# EAGLE design v3b_pcb (EAGLE 6.5.0)
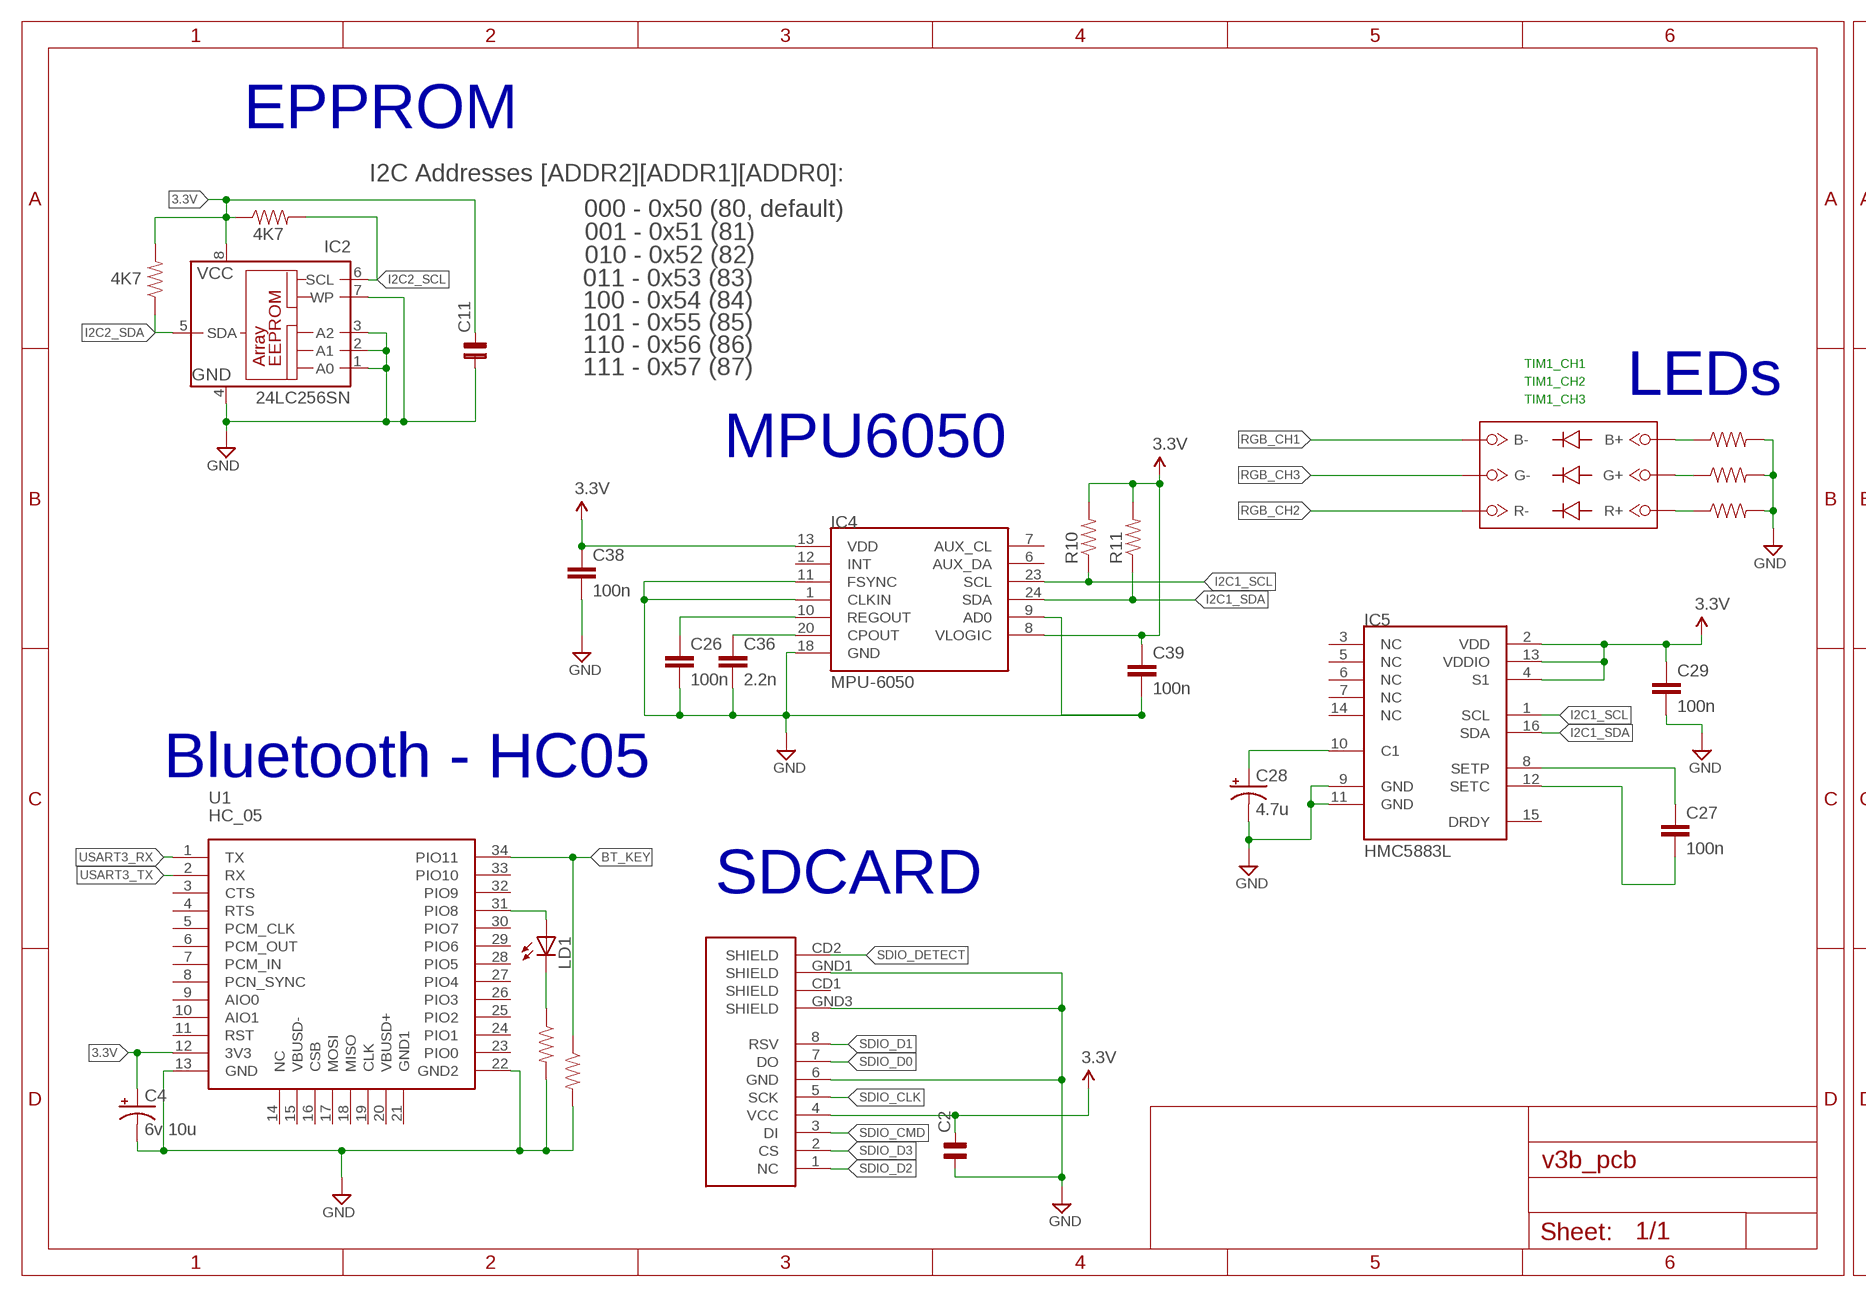
[diagram p0: schematic, sheet 1, part 1 of 2]
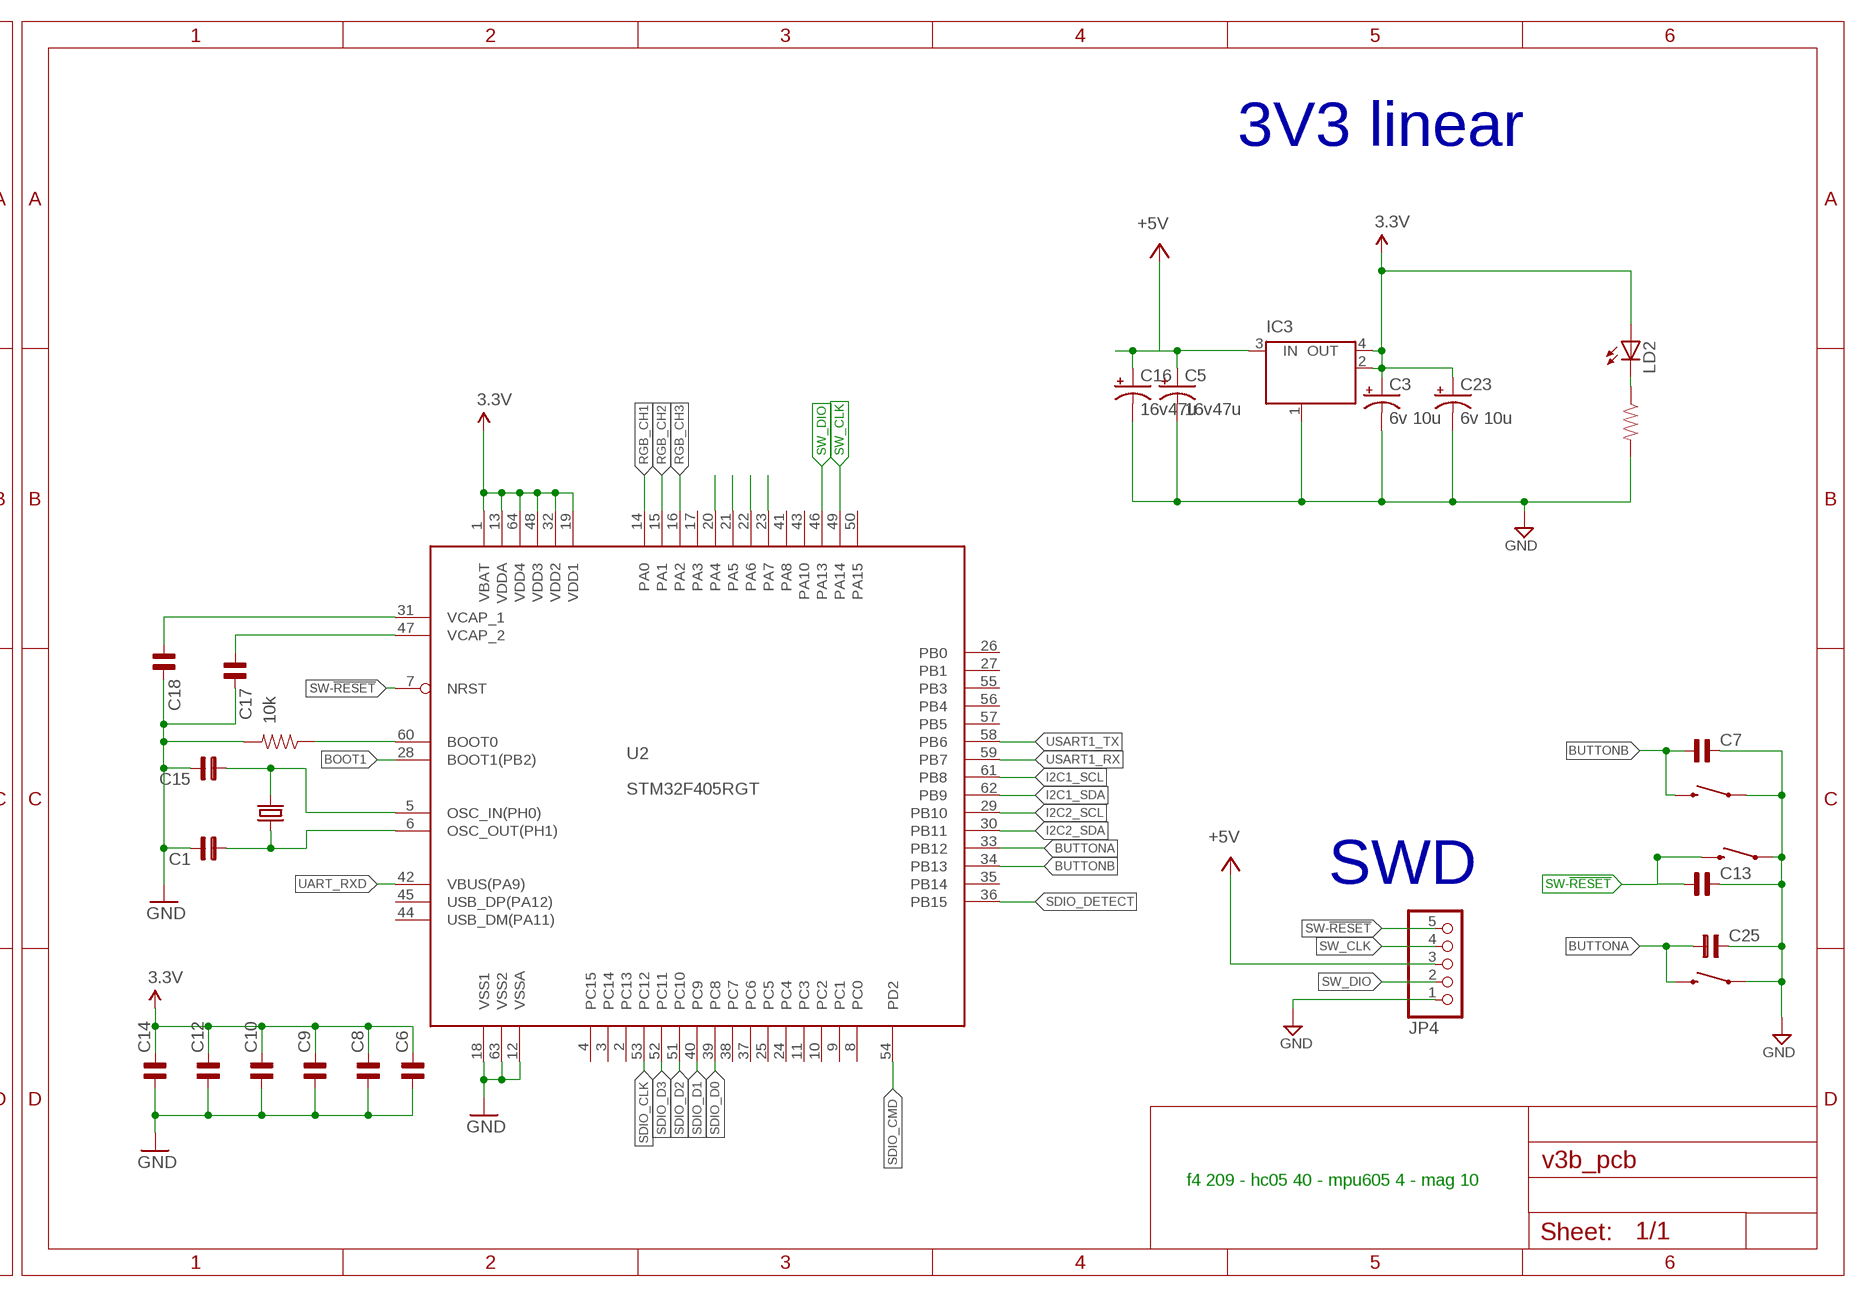
[diagram p1: schematic, sheet 1, part 2 of 2]

## Parts
C1  C-NP-SMD-0603  [C-0603]
C2  C-NP-SMD-0603  [C-0603]
C3  6v 10u  CPOL-USSMCC  [SMC_C]
C4  6v 10u  CPOL-USSMCA  [SMC_A]
C5  16v47u  CPOL-USSMCC  [SMC_C]
C6  C-NP-SMD-0603  [C-0603]
C7  C-NP-SMD-0603  [C-0603]
C8  C-NP-SMD-0603  [C-0603]
C9  C-NP-SMD-0603  [C-0603]
C10  C-NP-SMD-0603  [C-0603]
C11  C-NP-SMD-0603  [C-0603]
C12  C-NP-SMD-0603  [C-0603]
C13  C-NP-SMD-0603  [C-0603]
C14  C-NP-SMD-0603  [C-0603]
C15  C-NP-SMD-0603  [C-0603]
C16  16v47u  CPOL-USSMCC  [SMC_C]
C17  C-NP-SMD-0603  [C-0603]
C18  C-NP-SMD-0603  [C-0603]
C23  6v 10u  CPOL-USSMCC  [SMC_C]
C25  C-NP-SMD-0603  [C-0603]
C26  100n  SPARKFUN_CAP0603-CAP  [SPARKFUN_0603-CAP]
C27  100n  SPARKFUN_CAP0603-CAP  [SPARKFUN_0603-CAP]
C28  4.7u  CPOL-USSMCA  [SMC_A]
C29  100n  SPARKFUN_CAP0603-CAP  [SPARKFUN_0603-CAP]
C36  2.2n  SPARKFUN_CAP0603-CAP  [SPARKFUN_0603-CAP]
C38  100n  SPARKFUN_CAP0603-CAP  [SPARKFUN_0603-CAP]
C39  100n  SPARKFUN_CAP0603-CAP  [SPARKFUN_0603-CAP]
IC2  24LC256SN  [SO-08]
IC3  LINEAR_MC33269ST-3.3T3  [LINEAR_SOT223]
IC4  MPU-6050  TESTING_MPU-6050-1  [TESTING_QFN-24-4MM2]
IC5  HMC5883L  SPARKFUN_HMC5883LSMD  [SPARKFUN_16LPCC]
JP4  PINHD-1X5_2.54-90°  [1X05/90]
LD1  LEDCHIPLED_0603  [CHIPLED_0603]
LD2  LEDCHIPLED_0603  [CHIPLED_0603]
R1  10K  SPARKFUN_RESISTOR0603-RES  [SPARKFUN_0603-RES]
R2  10K  SPARKFUN_RESISTOR0603-RES  [SPARKFUN_0603-RES]
R3  10K  SPARKFUN_RESISTOR0603-RES  [SPARKFUN_0603-RES]
R5  10K  SPARKFUN_RESISTOR0603-RES  [SPARKFUN_0603-RES]
R6  10K  SPARKFUN_RESISTOR0603-RES  [SPARKFUN_0603-RES]
R7  10k  SPARKFUN_RESISTOR0603-RES  [SPARKFUN_0603-RES]
R9  10K  SPARKFUN_RESISTOR0603-RES  [SPARKFUN_0603-RES]
R10  SPARKFUN_RESISTOR0603-RES  [SPARKFUN_0603-RES]
R11  SPARKFUN_RESISTOR0603-RES  [SPARKFUN_0603-RES]
R15  4K7  SPARKFUN_RESISTOR0603-RES  [SPARKFUN_0603-RES]
R16  4K7  SPARKFUN_RESISTOR0603-RES  [SPARKFUN_0603-RES]
S1  RESET  SWITCH-MOMENTARY-2-SMD-1101NE  [TACTILE-SWITCH-1101NE]
S2  RESET  SWITCH-MOMENTARY-2-SMD-1101NE  [TACTILE-SWITCH-1101NE]
S4  RESET  SWITCH-MOMENTARY-2-SMD-1101NE  [TACTILE-SWITCH-1101NE]
SDCARD2  microSD Socket  USD-SOCKETNEW  [MICRO-SD-SOCKET-PP]
U1  HC_05  [BLUETOOTH_SMD]
U2  STM32F405RGT  [LQFP64]
U$12  RGB_LED  [SMD]
Y2  CRYSTALHC49US  [HC49US]

## Nets
3.3V: C2.2 C3.+ C4.+ C6.2 C8.2 C9.2 C10.2 C11.2 C12.2 C14.2 C23.+ C29.1 C38.1 C39.1 IC2.8(VCC) IC3.2(OUT) IC3.4(OUT) IC4.8(VLOGIC) IC4.13(VDD) IC5.2(VDD) IC5.4(S1) IC5.13(VDDIO) LD2.A R10.2 R11.2 R15.1 R16.2 SDCARD2.4(VCC) U1.12(3V3) U2.1(VBAT) U2.13(VDDA) U2.19(VDD1) U2.32(VDD2) U2.48(VDD3) U2.64(VDD4)
+5V: C5.+ C16.+ IC3.3(IN) JP4.3
BOOT0: R7.1 U2.60(BOOT0)
BOOT1: U2.28(BOOT1(PB2))
BT_KEY: R5.1 U1.34(PIO11)
BUTTONA: C25.1 S2.P$2 U2.33(PB12)
BUTTONB: C7.1 S4.P$2 U2.34(PB13)
GND: C1.2 C2.1 C3.- C4.- C5.- C6.1 C7.2 C8.1 C9.1 C10.1 C11.1 C12.1 C13.2 C14.1 C15.2 C16.- C17.2 C18.2 C23.- C25.2 C26.2 C28.- C29.2 C36.2 C38.2 C39.2 IC2.1(A0) IC2.2(A1) IC2.3(A2) IC2.4(GND) IC2.7(WP) IC3.1(GND/ADJ) IC4.1(CLKIN) IC4.9(AD0) IC4.11(FSYNC) IC4.18(GND) IC5.9(GND) IC5.11(GND) JP4.1 R1.2 R2.2 R3.2 R5.2 R6.2 R7.2 R9.2 S1.P$1 S2.P$1 S4.P$1 SDCARD2.6(GND) SDCARD2.GND1(SHIELD) SDCARD2.GND3(SHIELD) U1.13(GND) U1.22(GND2) U2.12(VSSA) U2.18(VSS1) U2.63(VSS2)
I2C1_SCL: IC4.23(SCL) IC5.1(SCL) R10.1 U2.61(PB8)
I2C1_SDA: IC4.24(SDA) IC5.16(SDA) R11.1 U2.62(PB9)
I2C2_SCL: IC2.6(SCL) R15.2 U2.29(PB10)
I2C2_SDA: IC2.5(SDA) R16.1 U2.30(PB11)
MISO: U2.22(PA6)
MOSI: U2.23(PA7)
N$2: R2.1 U$12.B+
N$3: C26.1 IC4.10(REGOUT)
N$4: LD1.A U1.31(PIO8)
N$5: LD1.C R9.1
N$6: R6.1 U$12.R+
N$7: R3.1 U$12.G+
N$8: C36.1 IC4.20(CPOUT)
N$10: C27.1 IC5.8(SETP)
N$11: LD2.C R1.1
N$12: C28.+ IC5.10(C1)
N$13: C27.2 IC5.12(SETC)
N$14: C15.1 U2.5(OSC_IN(PH0)) Y2.2
N$15: C1.1 U2.6(OSC_OUT(PH1)) Y2.1
N$18: C18.1 U2.31(VCAP_1)
N$19: C17.1 U2.47(VCAP_2)
NSS: U2.20(PA4)
RGB_CH1: U2.14(PA0) U$12.B-
RGB_CH2: U2.15(PA1) U$12.R-
RGB_CH3: U2.16(PA2) U$12.G-
SCK: U2.21(PA5)
SDIO_CLK: SDCARD2.5(SCK) U2.53(PC12)
SDIO_CMD: SDCARD2.3(DI) U2.54(PD2)
SDIO_D0: SDCARD2.7(DO) U2.39(PC8)
SDIO_D1: SDCARD2.8(RSV) U2.40(PC9)
SDIO_D2: SDCARD2.1(NC) U2.51(PC10)
SDIO_D3: SDCARD2.2(CS) U2.52(PC11)
SDIO_DETECT: SDCARD2.CD2(SHIELD) U2.36(PB15)
SW-!RESET: C13.1 JP4.5 S1.P$2 U2.7(NRST)
SW_CLK: JP4.4 U2.49(PA14)
SW_DIO: JP4.2 U2.46(PA13)
UART_RXD: U2.42(VBUS(PA9))
USART1_RX: U2.59(PB7)
USART1_TX: U2.58(PB6)
USART3_RX: U1.1(TX)
USART3_TX: U1.2(RX)
Unconnected: IC4.6(AUX_DA) IC4.7(AUX_CL) IC4.12(INT) IC5.3(NC) IC5.5(NC) IC5.6(NC) IC5.7(NC) IC5.14(NC) IC5.15(DRDY) SDCARD2.CD1(SHIELD) U1.3(CTS) U1.4(RTS) U1.5(PCM_CLK) U1.6(PCM_OUT) U1.7(PCM_IN) U1.8(PCN_SYNC) U1.9(AIO0) U1.10(AIO1) U1.11(RST) U1.14(NC) U1.15(VBUSD-) U1.16(CSB) U1.17(MOSI) U1.18(MISO) U1.19(CLK) U1.20(VBUSD+) U1.21(GND1) U1.23(PIO0) U1.24(PIO1) U1.25(PIO2) U1.26(PIO3) U1.27(PIO4) U1.28(PIO5) U1.29(PIO6) U1.30(PIO7) U1.32(PIO9) U1.33(PIO10) U2.2(PC13) U2.3(PC14) U2.4(PC15) U2.8(PC0) U2.9(PC1) U2.10(PC2) U2.11(PC3) U2.17(PA3) U2.24(PC4) U2.25(PC5) U2.26(PB0) U2.27(PB1) U2.35(PB14) U2.37(PC6) U2.38(PC7) U2.41(PA8) U2.43(PA10) U2.44(USB_DM(PA11)) U2.45(USB_DP(PA12)) U2.50(PA15) U2.55(PB3) U2.56(PB4) U2.57(PB5)

## Notes on the sheet
- EPPROM | 3V3 linear
- I2C Addresses [ADDR2][ADDR1][ADDR0]:
- 000 - 0x50 (80, default)
- 001 - 0x51 (81)
- 010 - 0x52 (82)
- 011 - 0x53 (83)
- 100 - 0x54 (84)
- 101 - 0x55 (85)
- 110 - 0x56 (86)
- TIM1_CH1
- 111 - 0x57 (87)
- TIM1_CH2
- LEDs
- TIM1_CH3
- MPU6050
- Bluetooth - HC05
- SDCARD
- SWD
- f4 209 - hc05 40 - mpu605 4 - mag 10
- TJA1040

## Library data of the parts
C1 C2 C6-C15 C17 C18 C25 = cap-pan40:C-NP: NON-POLARIZED FILM/CHIP
C3-C5 C16 C23 C28 = rcl:CPOL-US: POLARIZED CAPACITOR, American symbol
C26 C27 C29 C36 C38 C39 = Helios_RLC:SPARKFUN_CAP: Capacitor Standard 0603 ceramic capacitor, and 0.1" leaded capacitor.
IC2 = microchip:24*: Serial EEPROM I2C; DIGIKEY: 24LC256-E/SN-ND; MF: MICROCHIP; MPN: 24LC256-I/SN; OC_FARNELL: 9757996; OC_NEWARK: 27C9144
IC3 = Robotech_Other:LINEAR_MC33269ST*: Adjustable Output Low Dropout Voltage Regulator 800 mA Source: http://www.onsemi.com/pub/Collateral/MC33269-D.PDF
IC4 = Helios_IMU:TESTING_MPU-6050
IC5 = Helios_IMU:SPARKFUN_HMC5883L: 3 Axis Digital Compass IC
JP4 = pinhead-1:PINHD-1X5: PIN HEADER
LD1 LD2 = led:LED: LED OSRAM: - CHIPLED LG R971, LG N971, LY N971, LG Q971, LY Q971, LO R971, LY R971 LH N974, LH R974 LS Q976, LO Q976, LY Q976 LO Q996 - Hyper CHIPLED LW Q18S LB Q993, LB Q99A, LB R99A - SideLED LS A670, LO A670, LY A670, LG A670, LP A670 LB A673, LV A673, LT A673, LW A673 LH A674 LY A675 LS A676, LA A676, LO A676, LY A676, LW A676 LS A679, LY A679, LG A679 - Hyper Micro SIDELED® LS Y876, LA Y876, LO Y876, LY Y876 LT Y87S - SmartLED LW L88C, LW L88S LB L89C, LB L89S, LG L890 LS L89K, LO L89K, LY L89K LS L896, LA L896, LO L896, LY L896 - TOPLED LS T670, LO T670, LY T670, LG T670, LP T670 LSG T670, LSP T670, LSY T670, LOP T670, LYG T670 LG T671, LOG T671, LSG T671 LB T673, LV T673, LT T673, LW T673 LH T674 LS T676, LA T676, LO T676, LY T676, LB T676, LH T676, LSB T676, LW T676 LB T67C, LV T67C, LT T67C, LS T67K, LO T67K, LY T67K, LW E67C LS E67B, LA E67B, LO E67B, LY E67B, LB E67C, LV E67C, LT E67C LW T67C LS T679, LY T679, LG T679 LS T770, LO T770, LY T770, LG T770, LP T770 LB T773, LV T773, LT T773, LW T773 LH T774 LS E675, LA E675, LY E675, LS T675 LS T776, LA T776, LO T776, LY T776, LB T776 LHGB T686 LT T68C, LB T68C - Hyper Mini TOPLED® LB M676 - Mini TOPLED Santana® LG M470 LS M47K, LO M47K, LY M47K Source: http://www.osram.convergy.de/
R1-R3 R5-R7 R9 R15 R16 = Robotech_RCL:SPARKFUN_RESISTOR: Resistor Basic schematic elements and footprints for 0603, 1206, and PTH resistors.
R10 R11 = Helios_RLC:SPARKFUN_RESISTOR: Resistor Basic schematic elements and footprints for 0603, 1206, and PTH resistors.
S1 S2 S4 = pixhawk2:SWITCH-MOMENTARY-2; PARTNO: EVQ-P7J01P
SDCARD2 = SparkFun:USD-SOCKET: microSD Socket Push-push type uSD socket. Schematic element and footprint production proven. Spark Fun Electronics SKU : PRT-00127. tDoc lines correctly indicate media card edge positions when inserting (unlocked, locked, depressed).
U1 = SerialPortBluetooth:HC_05
U2 = m4quad:STM32F405RGT
U$12 = RGB_LED:RGB_LED
Y2 = SparkFun-FreqCtrl:CRYSTAL: Various standard crystals. Proven footprints. Spark Fun Electronics SKU : COM-00534

## Net classes
1 power: width 0.15 mm, drill 0.2 mm, clearance 0.152 mm

## Board
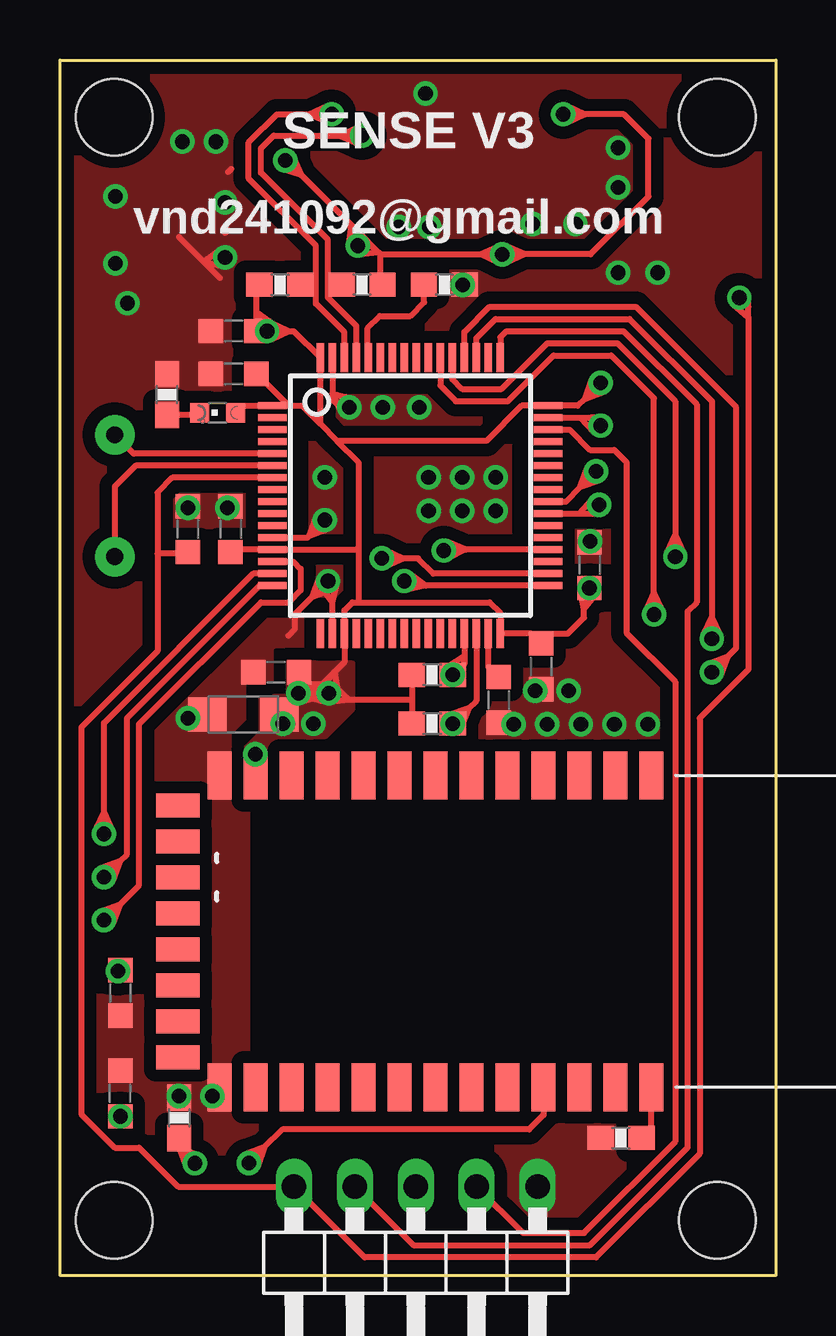
[diagram p2: board, top side]
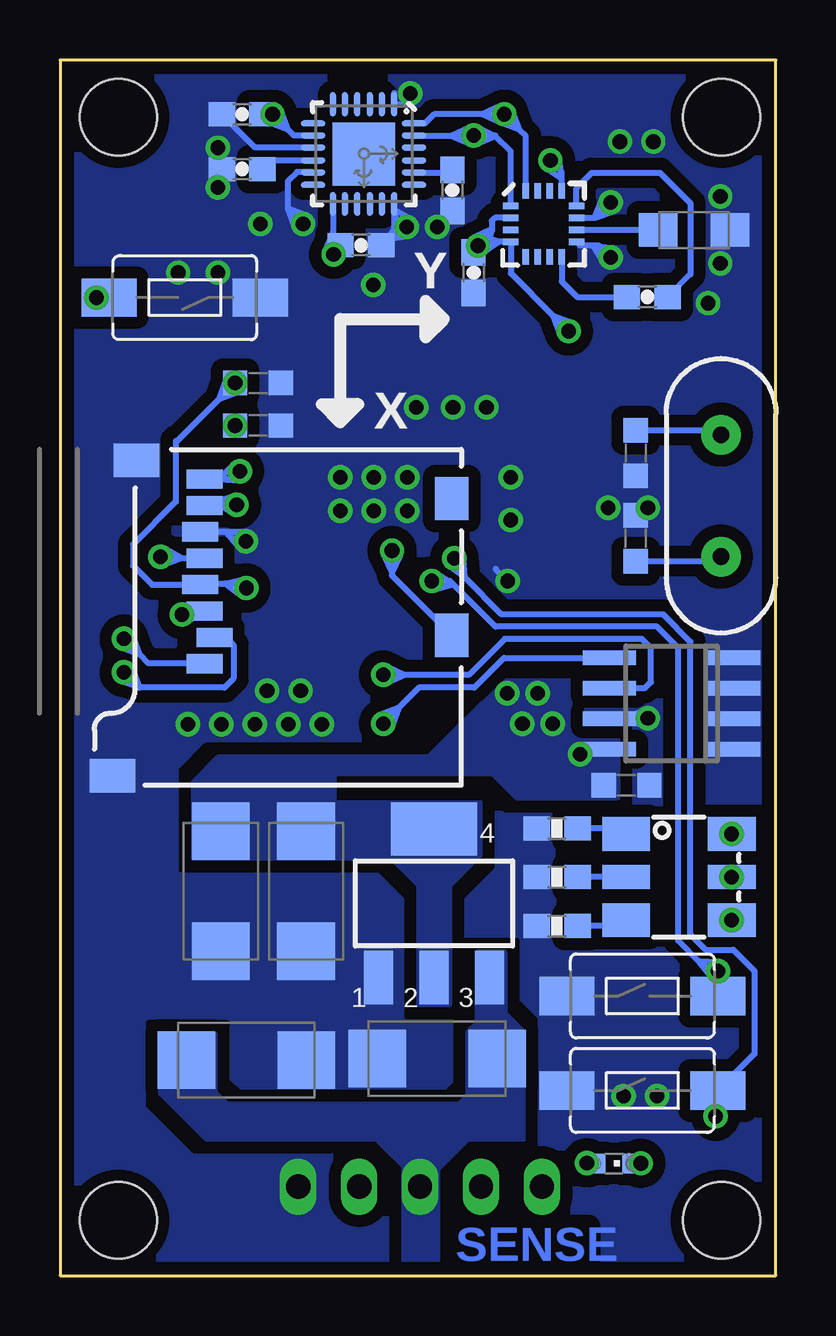
[diagram p3: board, bottom side, seen from below]

Size 29.84 x 50.67 mm. Coordinates in mm from the lower left corner, seen from the top.
Outline: 0,50.67 29.84,50.67 29.84,0 0,0 0,50.67
Copper layers (1*16): Top 0.035mm / dielectric 1.5mm / Bottom 0.035mm
Design rules "default *": minimum track width 10mil, minimum drill 24mil, track to track 8mil, track to pad 8mil, pad to pad 8mil, via to via 10mil, smd to smd 8mil, copper to edge 20mil, drill to drill 10mil, minimum pad ring 10mil, minimum via ring 8mil, stop-mask expansion 0mil, vias tented up to drill 100mil, thermal gap 10mil
Holes 3.2 mm at 27.41,48.29 2.26,48.29 27.41,2.31 2.26,2.31

### Footprints (pad centres in the part's own frame; a part is rotated, then mirrored left to right if it is on the bottom)
C-0603 = smd 1.016 x 1.016: 1 -0.953,0; 2 0.953,0
SMC_C = smd 2.4 x 2.4: + -2.5,0; - 2.5,0
SMC_A = smd 1.6 x 1.4: + -1.5,0; - 1.5,0
SPARKFUN_0603-CAP = smd 1.1 x 1: 1 -0.85,0; 2 0.85,0
SO-08 = smd 0.6 x 2.2: 1 -1.905,-2.6; 2 -0.635,-2.6; 3 0.635,-2.6; 4 1.905,-2.6; 5 1.905,2.6; 6 0.635,2.6; 7 -0.635,2.6; 8 -1.905,2.6
LINEAR_SOT223 = smd 1.219 x 2.235: 1 -2.311,-3.099; 2 0,-3.099; 3 2.311,-3.099 | smd 3.6 x 2.2: 4 0,3.099
TESTING_QFN-24-4MM2 = smd 1.016 x 0.254: 1 -2.066,1.257; 2 -2.066,0.75; 3 -2.066,0.247; 4 -2.066,-0.287; 5 -2.066,-0.792; 6 -2.066,-1.297; 13 2.086,-1.297; 14 2.086,-0.792; 15 2.086,-0.287; 16 2.086,0.247; 17 2.086,0.75; 18 2.086,1.257 | smd 0.254 x 1.016: 7 -1.267,-2.122; 8 -0.762,-2.122; 9 -0.258,-2.122; 10 0.278,-2.122; 11 0.78,-2.122; 12 1.287,-2.122; 19 1.287,2.082; 20 0.78,2.082; 21 0.278,2.082; 22 -0.258,2.082; 23 -0.762,2.082; 24 -1.267,2.082 | smd 2.616 x 2.616: P$1 0.02,-0.01
SPARKFUN_16LPCC = smd 0.65 x 0.28: 1 -1.37,0.75; 2 -1.37,0.25; 3 -1.37,-0.25; 4 -1.37,-0.75; 9 1.37,-0.75; 10 1.37,-0.25; 11 1.37,0.25; 12 1.37,0.75 | smd 0.28 x 0.65: 5 -0.75,-1.37; 6 -0.25,-1.37; 7 0.25,-1.37; 8 0.75,-1.37; 13 0.75,1.37; 14 0.25,1.37; 15 -0.25,1.37; 16 -0.75,1.37
1X05/90 = drill 1.016 long: 1 -5.08,-3.81; 2 -2.54,-3.81; 3 0,-3.81; 4 2.54,-3.81; 5 5.08,-3.81
CHIPLED_0603 = smd 0.8 x 0.8: A 0,-0.75; C 0,0.75
SPARKFUN_0603-RES = smd 1.1 x 1: 1 -0.85,0; 2 0.85,0
TACTILE-SWITCH-1101NE = smd 2.3 x 1.6: P$1 -3.15,0; P$2 3.15,0
MICRO-SD-SOCKET-PP = smd 0.8 x 1.5: 1 -8.94,10.7; 2 -7.84,10.3; 3 -6.74,10.7; 4 -5.64,10.9; 5 -4.54,10.7; 6 -3.44,10.9; 7 -2.34,10.7; 8 -1.24,10.7 | smd 1.8 x 1.4: CD1 -2.05,0.4; CD2 -7.75,0.4 | smd 1.4 x 1.9: GND1 -13.6,14.55; GND3 -0.45,13.55
BLUETOOTH_SMD = smd 2 x 1: 1 0,0; 2 0,-1.5; 3 0,-3; 4 0,-4.5; 5 0,-6; 6 0,-7.5; 7 0,-9; 8 0,-10.5; 9 0,-12; 10 0,-13.5; 11 0,-15; 12 0,-16.5; 13 0,-18; 22 13,-18; 23 13,-16.5; 24 13,-15; 25 13,-13.5; 26 13,-12; 27 13,-10.5; 28 13,-9; 29 13,-7.5; 30 13,-6; 31 13,-4.5; 32 13,-3; 33 13,-1.5; 34 13,0 | smd 1 x 1.8: 14 1.25,-19.75; 15 2.75,-19.75; 16 4.25,-19.75; 17 5.75,-19.75; 18 7.25,-19.75; 19 8.75,-19.75; 20 10.25,-19.75; 21 11.75,-19.75
LQFP64 = smd 0.3 x 1.2: 1 -3.75,-5.75; 2 -3.25,-5.75; 3 -2.75,-5.75; 4 -2.25,-5.75; 5 -1.75,-5.75; 6 -1.25,-5.75; 7 -0.75,-5.75; 8 -0.25,-5.75; 9 0.25,-5.75; 10 0.75,-5.75; 11 1.25,-5.75; 12 1.75,-5.75; 13 2.25,-5.75; 14 2.75,-5.75; 15 3.25,-5.75; 16 3.75,-5.75; 33 3.75,5.75; 34 3.25,5.75; 35 2.75,5.75; 36 2.25,5.75; 37 1.75,5.75; 38 1.25,5.75; 39 0.75,5.75; 40 0.25,5.75; 41 -0.25,5.75; 42 -0.75,5.75; 43 -1.25,5.75; 44 -1.75,5.75; 45 -2.25,5.75; 46 -2.75,5.75; 47 -3.25,5.75; 48 -3.75,5.75 | smd 1.2 x 0.3: 17 5.75,-3.75; 18 5.75,-3.25; 19 5.75,-2.75; 20 5.75,-2.25; 21 5.75,-1.75; 22 5.75,-1.25; 23 5.75,-0.75; 24 5.75,-0.25; 25 5.75,0.25; 26 5.75,0.75; 27 5.75,1.25; 28 5.75,1.75; 29 5.75,2.25; 30 5.75,2.75; 31 5.75,3.25; 32 5.75,3.75; 49 -5.75,3.75; 50 -5.75,3.25; 51 -5.75,2.75; 52 -5.75,2.25; 53 -5.75,1.75; 54 -5.75,1.25; 55 -5.75,0.75; 56 -5.75,0.25; 57 -5.75,-0.25; 58 -5.75,-0.75; 59 -5.75,-1.25; 60 -5.75,-1.75; 61 -5.75,-2.25; 62 -5.75,-2.75; 63 -5.75,-3.25; 64 -5.75,-3.75
SMD = smd 1.99 x 1.4: B+ -2.2,-1.8; B- 2.2,-1.8; R+ -2.2,1.8; R- 2.2,1.8 | smd 1.99 x 1: G+ -2.2,0; G- 2.2,0
HC49US = drill 0.7 pad 1.651: 1 -2.54,0; 2 2.54,0

### Placement (x,y rotation side)
C1  5.84,30.73 90 bottom
C2  22.07,29.62 270 top
C3  19.58,16.03 270 bottom
C4  7.65,23.39 180 top
C5  14.12,9.04 180 bottom
C6  7.24,37.59 0 top
C7  2.51,7.59 90 top
C8  21.59,37.21 180 bottom
C9  7.11,31.11 270 top
C10  7.24,39.37 0 top
C11  6.22,20.45 180 bottom
C12  20.07,25.4 90 top
C13  5.33,31.11 90 top
C14  9.02,25.15 0 top
C15  5.84,34.29 270 bottom
C16  22.07,8.99 0 bottom
C17  21.59,35.43 0 bottom
C18  18.29,24 270 top
C23  23.14,16.03 270 bottom
C25  2.51,11.79 270 top
C26  22.25,46.13 180 bottom
C27  5.36,40.79 0 bottom
C28  3.4,43.59 0 bottom
C29  12.6,41.81 270 bottom
C36  13.49,45.24 270 bottom
C38  17.3,42.95 0 bottom
C39  22.25,48.41 180 bottom
IC2  4.34,23.85 90 bottom
IC3  14.25,15.52 0 bottom
IC4  17.17,46.76 270 bottom
IC5  9.68,43.84 0 bottom
JP4  14.83,-0.1 180 top
LD1  6.76,4.67 270 bottom
LD2  6.58,35.97 90 top
R1  4.47,36.73 90 top
R2  9.12,14.58 180 bottom
R3  9.12,16.61 180 bottom
R5  23.39,5.74 180 top
R6  9.12,18.64 180 bottom
R7  16.03,41.3 0 top
R9  4.98,6.58 90 top
R10  12.6,41.3 0 top
R11  9.17,41.3 180 top
R15  15.52,25.04 0 top
R16  15.52,23.01 180 top
S1  24.64,40.77 180 bottom
S2  5.56,11.66 0 bottom
S4  5.56,7.72 0 bottom
SDCARD2  13.11,34.44 90 bottom
U1  24.66,20.85 270 top
U2  14.61,32.51 270 top
U$12  4.04,16.61 0 bottom
Y2  2.29,32.51 90 bottom

### Tracks (layer width: path | path; a pad name or v marks a point on that pad's centre or on a via)
3.3V  (via drill 0.61)
  Top 0.254: 21.89,48.41 23.52,48.41 24.54,47.4 24.54,44.98 22.12,42.57 19.36,42.57 | 21.89,48.41 v20.98,48.41 | 13.36,42.57 13.36,41.39 R10.2 13.49,41.34 | v12.42,42.94 12.42,43.51 | 13.36,42.57 13.29,42.65 | 13.29,42.65 12.42,43.51 | 19.36,42.57 v18.44,42.57 | 13.36,42.57 17.53,42.57 | 17.53,42.57 v18.44,42.57 | C12.2 19.66,26.76 | 19.66,26.76 U2.32 18.36,27.62 17.91,28.07 12.45,28.07 | 11.45,25.16 11.86,25.57 U2.19 11.86,27.73 12.19,28.07 12.45,28.07 | 11.45,25.16 10.92,24.64 10.77,24.64 | 10.77,24.64 10.36,24.64 | 10.36,24.64 9.65,24.64 | R15.1 14.67,24 | 14.67,24 R16.2 | 14.67,24 12.07,24 | 12.07,24 11.81,24 | 19.66,26.76 21.17,26.76 21.84,27.43 21.84,27.78 | 21.84,27.78 21.84,28.43 | 21.84,28.43 21.84,28.56 | 9.52,36.26 U2.1 7.62,36.26 LD2.A | 11.56,34.8 12.45,33.91 12.45,30.35 | 11.56,34.8 10.86,35.5 | 10.86,35.5 U2.64 9.75,39.37 9.55,39.37 | 10.86,35.5 10.09,36.26 9.52,36.26 | v8.64,39.37 9.55,39.37 | v8.64,39.37 C10.2 8.19,40.17 | 8.19,40.17 8.19,41.17 R11.2 | C6.2 9.52,36.26 | 21.9,36.56 21.59,36.26 U2.48 19.24,36.26 17.78,34.8 11.56,34.8 | 21.9,36.56 | 21.9,36.56 C8.2 | 12.45,30.35 12.45,28.07 | 12.45,30.35 12.36,30.26 U2.13 7.21,30.26 C9.2 | v9.4,46.48 9.45,46.48 10.07,45.86 | 10.07,45.86 12.13,43.8 | 12.13,43.8 12.42,43.51 | U1.12 8.15,20.86 v8.15,21.74 | C2.2 21.84,28.43 | 10.36,24.64 10.77,24.65 | 10.77,24.65 11.19,24.66 | 13.29,42.65 12.68,43.21 v12.42,42.94 | 13.29,42.65 12.46,42.56 v12.42,42.94 | 12.13,43.8 12.04,42.98 v12.42,42.94 | 12.13,43.8 12.7,43.2 v12.42,42.94 | 21.89,48.41 | 21.89,48.41 21.14,48.76 | v20.98,48.41 21.14,48.76 | 21.89,48.41 | 21.89,48.41 21.14,48.07 | v20.98,48.41 21.14,48.07 | 21.89,48.41 21.14,48.76 | 21.14,48.76
  Top 0.254: v20.98,48.41 21.14,48.76 | 21.89,48.41 21.14,48.07 | v20.98,48.41 21.14,48.07 | 21.89,48.41 21.14,48.76 | v20.98,48.41 21.14,48.76 | 21.89,48.41 21.14,48.07 | v20.98,48.41 21.14,48.07 | 19.36,42.57 | 19.36,42.57 18.6,42.92 | v18.44,42.57 18.6,42.92 | 19.36,42.57 | 19.36,42.57 18.6,42.22 | v18.44,42.57 18.6,42.22 | 19.36,42.57 18.6,42.92 | 18.6,42.92 | v18.44,42.57 18.6,42.92 | 19.36,42.57 18.6,42.22 | v18.44,42.57 18.6,42.22 | 19.36,42.57 18.6,42.92 | v18.44,42.57 18.6,42.92 | 19.36,42.57 18.6,42.22 | v18.44,42.57 18.6,42.22 | 17.53,42.57 18.28,42.22 | 18.28,42.22 | v18.44,42.57 18.28,42.22 | 17.53,42.57 18.28,42.92 | v18.44,42.57 18.28,42.92 | 17.53,42.57 18.28,42.22 | v18.44,42.57 18.28,42.22 | 17.53,42.57 18.28,42.92 | v18.44,42.57 18.28,42.92 | 9.55,39.37 | 9.55,39.37 8.79,39.72 | v8.64,39.37 8.79,39.72 | 9.55,39.37 | 9.55,39.37 8.79,39.02 | v8.64,39.37 8.79,39.02 | 9.55,39.37 8.79,39.72 | 8.79,39.72 | v8.64,39.37 8.79,39.72 | 9.55,39.37 8.79,39.02 | v8.64,39.37 8.79,39.02 | 9.55,39.37 8.79,39.72 | v8.64,39.37 8.79,39.72 | 9.55,39.37 8.79,39.02 | v8.64,39.37 8.79,39.02 | 8.19,40.17 8.26,39.34 v8.64,39.37 | 8.19,40.17 8.86,39.68 v8.64,39.37 | 21.9,36.56 22.68,36.85 | C8.2 22.68,36.85 | 21.9,36.56 | 21.9,36.56 22.18,37.34 | C8.2 22.18,37.34 | 21.9,36.56 22.68,36.85 | 21.9,36.56 22.18,37.34 | 21.9,36.56 22.68,36.85 | C8.2 22.68,36.85 | 21.9,36.56 22.18,37.34 | C8.2 22.18,37.34 | 10.07,45.86 9.75,46.63 v9.4,46.48 | 10.07,45.86 9.28,46.12 v9.4,46.48 | 10.77,24.64 10.36,24.65 | 10.36,24.65 9.94,24.66 v9.93,24.28 | 10.77,24.64 10.3,24.12 | 10.3,24.12 10.21,24.02 v9.93,24.28 | v9.93,24.28 10.15,24.6 10.83,24.12 10.03,23.91 v9.93,24.28 | 10.77,24.65 9.94,24.66 v9.93,24.28 | 10.77,24.65 10.22,24.03 v9.93,24.28
  Top 0.254: 10.36,24.65 10.92,24.03 v11.2,24.28 | 10.36,24.65 11.2,24.66 v11.2,24.28 | 10.3,24.12 11.11,23.91 v11.2,24.28 | 10.3,24.12 10.98,24.6 v11.2,24.28 | 11.45,25.16 10.91,24.53 v11.2,24.28 | 11.45,25.16 11.58,24.34 v11.2,24.28 | 10.36,24.64 10.92,24.02 v11.2,24.28 | 10.36,24.64 11.19,24.66 | v11.2,24.28 11.19,24.66 | 12.07,24 11.46,24.56 v11.2,24.28 | 12.07,24 11.25,23.9 v11.2,24.28 | 21.84,27.78 22.37,28.42 C2.2 | 21.84,27.78 21.7,28.6 C2.2
  Bottom 0.254: v20.98,48.41 C39.1 | IC4.8 20.09,47.52 20.33,47.77 | 20.33,47.77 | 20.33,47.77 v20.98,48.41 | v12.42,42.94 12.26,43.09 12.22,43.09 | 24.03,28.82 24.03,28.85 24.01,28.85 | 11.52,43.09 IC5.4 11.05,41.78 9.28,40.02 | 11.52,43.09 12.22,43.09 | IC5.2 11.71,44.09 11.84,43.97 11.84,43.64 | 11.84,43.64 11.84,43.52 v12.42,42.94 | IC4.13 18.47,43.48 | 18.47,43.48 18.47,43.27 C38.1 17.93,43.17 17.93,43.2 18.44,42.7 v18.44,42.57 | C29.1 12.22,43.04 12.22,43.09 | 24.01,28.85 SDCARD2.4 26.01,28.8 26.8,29.59 26.8,30.48 25.02,32.26 25.02,34.73 | 20.09,18.53 C3.+ | 9.28,40.02 | 9.28,40.02 v8.64,39.37 | 25.02,34.8 25.02,34.73 | C8.2 23.19,36.56 | 23.19,36.56 | 23.19,36.56 25.02,34.73 | IC5.13 8.93,45.7 | 8.93,45.7 8.93,46.01 v9.4,46.48 | 24.01,28.85 22.97,28.85 | 22.97,28.85 22.26,28.85 C2.2 | 11.52,43.09 12.2,42.62 v12.42,42.94 | 11.52,43.09 12.32,43.3 v12.42,42.94 | 11.84,43.64 12.05,42.84 v12.42,42.94 | 11.84,43.64 12.59,43.28 v12.42,42.94 | 20.33,47.77 21.11,48.05 | v20.98,48.41 21.11,48.05 | 20.33,47.77 | 20.33,47.77 20.62,48.55 | v20.98,48.41 20.62,48.55 | 20.33,47.77 21.11,48.05 | 20.33,47.77 20.62,48.55 | 20.33,47.77 21.11,48.05 | v20.98,48.41 21.11,48.05 | 20.33,47.77 20.62,48.55 | v20.98,48.41 20.62,48.55 | 18.47,43.48 18.1,42.74 v18.44,42.57 | 18.47,43.48 18.79,42.72 v18.44,42.57 | 9.28,40.02 | 9.28,40.02 8.5,39.73 | v8.64,39.37 8.5,39.73 | 9.28,40.02 8.99,39.24 | v8.64,39.37 8.99,39.24 | 9.28,40.02 8.5,39.73 | 9.28,40.02 | 9.28,40.02 8.5,39.73 | v8.64,39.37 8.5,39.73 | 9.28,40.02 8.99,39.24 | v8.64,39.37 8.99,39.24 | 23.19,36.56 22.9,37.34 | C8.2 22.9,37.34 | 23.19,36.56 22.41,36.85 | C8.2 22.41,36.85 | 23.19,36.56 22.9,37.34 | C8.2 22.9,37.34 | 23.19,36.56 22.41,36.85
  Bottom 0.254: C8.2 22.41,36.85 | 8.93,45.7 9.61,46.17 v9.4,46.48 | 8.93,45.7 9.02,46.52 v9.4,46.48 | 22.97,28.85 22.16,29.04 C2.2 | 22.97,28.85 22.3,28.36 C2.2
  other vias: 22.54,37.21 9.3,23.01 10.57,23.01 22.07,28.66
  pour Bottom (isolate 0.508, no thermals): 24.28,17.42 16.03,17.42 14.88,16.28 14.88,11.33 13.61,11.33 13.61,16.28 12.34,17.55 12.34,19.71 18.41,19.68 18.41,20.95 11.81,20.95 10.79,19.94 6.6,19.94 6.6,24.77 11.3,24.77 14.48,21.59 23.24,21.59 24.28,20.55
  pour Top (isolate 0.508, no thermals): 9.14,22.48 11.05,22.48 12.19,23.62 12.19,25.53 9.53,25.53 9.53,24.13 8.38,24.13 8.38,22.61 7.77,22 7.77,21.87 8.53,21.87
+5V
  pour Bottom (no thermals): 25.65,10.03 25.65,7.62 23.75,5.71 16.64,5.71 15.49,4.57 15.49,0.13 14.1,0.13 14.1,4.45 12.83,5.71 10.54,5.71 10.54,10.16 11.3,10.92 11.3,13.46 12.45,13.46 12.45,10.54 12.83,10.16 12.83,7.49 13.21,7.11 22.86,7.11 23.37,7.62 23.37,10.03
BOOT0
  Top 0.254: 15.14,41.26 R7.1 15.18,40.58 14.61,40.01 13.34,40.01 12.83,39.5 12.83,38.23 U2.60
BT_KEY
  Top 0.254: R5.1 24.66,6.16 U1.34
BUTTONA  (via drill 0.61)
  Top 0.254: U2.33 15.24,28.76 | 15.24,28.76 14.54,28.76 v14.35,28.96 | C25.1 2.48,12.7 v2.41,12.7 | 15.24,28.76 14.58,29.26 v14.35,28.96 | 15.24,28.76 14.43,28.58 v14.35,28.96
  Bottom 0.254: 13.45,28.82 13.59,28.96 v14.35,28.96 | 13.45,28.82 11.68,27.05 4.95,27.05 4.06,26.16 4.06,13.97 3.22,13.13 | 3.22,13.13 2.79,12.7 v2.41,12.7 | S2.P$2 | S2.P$2 2.41,11.79 | 2.41,11.79 v2.41,12.7 | 13.45,28.82 14.25,28.59 v14.35,28.96 | 13.45,28.82 14.14,29.27 v14.35,28.96 | 3.22,13.13 | 3.22,13.13 2.39,13.08 | v2.41,12.7 2.39,13.08 | 3.22,13.13 | 3.22,13.13 2.71,12.47 | v2.41,12.7 2.71,12.47 | 2.41,11.79 2.76,12.54 | v2.41,12.7 2.76,12.54 | 2.41,11.79 2.07,12.54 | v2.41,12.7 2.07,12.54 | 3.22,13.13 2.39,13.08 | 3.22,13.13 2.71,12.47 | v2.41,12.7 2.71,12.47 | 3.22,13.13 2.39,13.08 | v2.41,12.7 2.39,13.08 | 3.22,13.13 2.71,12.47 | v2.41,12.7 2.71,12.47 | 2.41,11.79 2.76,12.54 | 2.76,12.54 | v2.41,12.7 2.76,12.54 | 2.41,11.79 2.07,12.54 | v2.41,12.7 2.07,12.54 | 2.41,11.79 2.76,12.54 | v2.41,12.7 2.76,12.54 | 2.41,11.79 2.07,12.54 | v2.41,12.7 2.07,12.54
BUTTONB  (via drill 0.61)
  Top 0.254: U2.34 15.57,29.26 14.93,29.9 14.32,29.9 | 14.32,29.9 v13.41,29.9 | C7.1 2.48,6.6 2.29,6.6 | 14.32,29.9 | 14.32,29.9 13.57,30.24 | v13.41,29.9 13.57,30.24 | 14.32,29.9 | 14.32,29.9 13.57,29.55 | v13.41,29.9 13.57,29.55 | 14.32,29.9 13.57,30.24 | 13.57,30.24 | v13.41,29.9 13.57,30.24 | 14.32,29.9 13.57,29.55 | v13.41,29.9 13.57,29.55 | 14.32,29.9 13.57,30.24 | v13.41,29.9 13.57,30.24 | 14.32,29.9 13.57,29.55 | v13.41,29.9 13.57,29.55
  Bottom 0.254: 2.44,7.75 S4.P$2 | S4.P$2 0.89,9.24 0.89,12.7 1.78,13.59 2.92,13.59 3.56,14.22 3.56,26.42 4.7,27.56 11.43,27.56 12.97,29.1 | C7.1 2.52,7.56 | 2.52,7.56 2.52,7.62 S4.P$2 | 12.97,29.1 13.41,29.54 v13.41,29.9 | 12.97,29.1 13.64,29.59 | v13.41,29.9 13.64,29.59 | 12.97,29.1 | 12.97,29.1 13.03,29.93 | v13.41,29.9 13.03,29.93 | 12.97,29.1 13.64,29.59 | v13.41,29.9 13.64,29.59 | 12.97,29.1 13.03,29.93 | v13.41,29.9 13.03,29.93 | 2.52,7.56 | 2.52,7.56 | 2.52,7.56 2.86,6.8 | 2.52,7.56 2.17,6.8 | 2.17,6.8 | C7.1 2.17,6.8 | 2.52,7.56 2.86,6.8 | C7.1 2.86,6.8 | 2.52,7.56 2.17,6.8 | C7.1 2.17,6.8 | 2.52,7.56 2.86,6.8 | C7.1 2.86,6.8
  other vias: 2.51,6.64
GND  (via drill 0.61)
  Top 0.254: 7.01,43.59 6.88,43.46 | 7.01,46 7.14,46.13 | U2.63 11.36,36.77 | 11.36,36.77 11.36,36.52 11.68,36.2 v12.06,36.2 | 22.1,30.85 v22.1,30.61 | U2.18 11.36,28.06 | 11.36,28.06 11.36,28.14 11.05,28.45 | 11.05,28.45 10.67,28.45 10.53,28.31 | 10.53,28.31 | 10.53,28.31 9.78,27.56 9.78,26.92 9.53,26.67 | 11.05,28.85 11.05,28.45 | 6.66,41.6 5.99,42.27 | 5.99,42.27 4.95,43.31 | U2.12 10.31,30.76 10.4,30.85 | 10.4,30.85 | 10.4,30.85 v11.05,31.5 | 5.99,42.27 6.79,42.07 v6.88,42.44 6.66,42.76 5.99,42.27 | 10.4,30.85 11.18,31.14 | v11.05,31.5 11.18,31.14 | 10.4,30.85 | 10.4,30.85 10.69,31.63 | v11.05,31.5 10.69,31.63 | 10.4,30.85 11.18,31.14 | 10.4,30.85 10.69,31.63 | 10.4,30.85 11.18,31.14 | v11.05,31.5 11.18,31.14 | 10.4,30.85 10.69,31.63 | v11.05,31.5 10.69,31.63 | 10.53,28.31 11.31,28.6 | v11.18,28.96 11.31,28.6 | 10.53,28.31 | 10.53,28.31 10.82,29.09 | v11.18,28.96 10.82,29.09 | 11.36,28.06 11.55,28.87 v11.18,28.96 | 11.36,28.06 10.87,28.73 v11.18,28.96 | 10.53,28.31 11.31,28.6 | 10.53,28.31 10.82,29.09 | 10.53,28.31 11.31,28.6 | v11.18,28.96 11.31,28.6 | 10.53,28.31 10.82,29.09 | v11.18,28.96 10.82,29.09 | 11.36,36.77 11.72,36.03 v12.06,36.2 | 11.36,36.77 12.16,36.56 v12.06,36.2
  Bottom 0.254: 23.01,48.32 C39.2 21.71,47.02 IC4.9 | IC5.11 7.65,44.09 7.64,44.09 7.54,44.09 | 15.91,49.29 IC4.1 15.48,48.83 15.48,49.05 15.23,49.3 15.14,49.3 | IC5.9 8.17,42.95 7.64,42.95 | 7.54,44.09 7.52,44.09 v6.88,44.73 | IC4.11 19.31,45.98 19.33,46 19.96,46 20.34,45.62 20.34,44.5 | IC4.18 15.91,44.47 | 15.91,44.47 15.91,43.48 16.17,43.23 | 16.17,43.23 C38.2 | 20.34,44.5 20.34,44.48 v19.71,43.84 | v11.18,28.96 11.68,29.46 | 22.11,31 22.92,31 | 22.92,31 SDCARD2.6 | 7.64,42.95 7.39,42.95 v6.88,42.44 | IC2.7 6.92,23.24 6.25,23.24 | 6.25,23.24 v5.33,23.24 | 7.64,42.95 6.82,42.82 v6.88,42.44 | 7.64,42.95 7.21,42.24 v6.88,42.44 | 7.54,44.09 7.24,44.87 v6.88,44.73 | 7.54,44.09 6.76,44.37 v6.88,44.73 | 16.17,43.23 | 16.17,43.23 15.71,43.92 | v15.39,43.71 15.71,43.92 | 16.17,43.23 15.34,43.34 | v15.39,43.71 15.34,43.34 | 15.91,44.47 15.2,44.04 v15.39,43.71 | 15.91,44.47 15.77,43.65 v15.39,43.71 | 16.17,43.23 15.71,43.92 | v15.39,43.71 15.71,43.92 | 16.17,43.23 15.71,43.92 | v15.39,43.71 15.71,43.92 | 16.17,43.23 15.34,43.34 | v15.39,43.71 15.34,43.34 | 20.34,44.5 19.57,44.2 v19.71,43.84 | 20.34,44.5 20.07,43.71 v19.71,43.84 | 22.92,31 22.09,30.99 v22.1,30.61 22.39,30.36 22.92,31 | 6.25,23.24 | 6.25,23.24 5.49,23.59 | v5.33,23.24 5.49,23.59 | 6.25,23.24 | 6.25,23.24 5.49,22.89 | v5.33,23.24 5.49,22.89 | 6.25,23.24 5.49,23.59 | 5.49,23.59 | v5.33,23.24 5.49,23.59 | 6.25,23.24 5.49,22.89 | v5.33,23.24 5.49,22.89 | 6.25,23.24 5.49,23.59 | v5.33,23.24 5.49,23.59 | 6.25,23.24 5.49,22.89 | v5.33,23.24 5.49,22.89
  other vias: 23.27,47.02 23.27,45.36 16.79,41.3 21.49,43.84 14.12,43.71 6.99,32 2.31,42.19 5.33,32 13.46,36.2 14.99,36.2 24.51,22.99 23.11,22.99 21.72,22.99 20.32,22.99 18.92,22.99 21.21,24.38 19.81,24.38 18.16,31.88 16.76,31.88 15.37,31.88 18.16,33.27 16.76,33.27 15.37,33.27 11.05,33.27 2.31,44.98 2.82,40.54 5.11,47.27 6.5,47.27 6.35,7.49 4.95,7.49 23.27,41.81 24.92,41.81 15.24,49.28
  pour Top (isolate 0.508, rank 6, no thermals): -2.64,51.46 -2.64,0 -2.39,-0.25 35.69,-0.25 35.94,0 35.94,9.02 8,9.02 7.75,9.27 7.75,19.43 8,19.68 35.69,19.68 35.94,19.94 35.94,51.82 -2.41,51.82 -2.67,51.56 -2.67,51.31
  pour Bottom (isolate 0.508, rank 6, no thermals): -5.69,50.44 29.62,50.44 29.36,-5.33 -5.71,-5.33
I2C1_SCL  (via drill 0.61)
  Top 0.254: U2.61 12.36,39.59 11.18,40.77 11.18,41.27 | 11.18,41.27 11.18,43.18 8.38,45.97 8.38,46.99 8.91,47.52 11.68,47.52 | 11.68,47.52 v12.6,47.52 | R10.1 11.72,41.27 11.18,41.27 | 11.68,47.52 12.44,47.18 | 12.44,47.18 | v12.6,47.52 12.44,47.18 | 11.68,47.52 12.44,47.87 | v12.6,47.52 12.44,47.87 | 11.68,47.52 12.44,47.18 | v12.6,47.52 12.44,47.18 | 11.68,47.52 12.44,47.87 | v12.6,47.52 12.44,47.87
  Bottom 0.254: IC4.23 | v12.6,47.52 11.71,47.52 11.68,47.5 | IC5.1 11.05,46.86 11.68,47.5 | IC4.23 13.51,47.52 | 13.51,47.52 v12.6,47.52 | 13.51,47.52 | 13.51,47.52 12.76,47.87 | v12.6,47.52 12.76,47.87 | 13.51,47.52 | 13.51,47.52 12.76,47.18 | v12.6,47.52 12.76,47.18 | 11.68,47.5 12.45,47.17 v12.6,47.52 | 11.68,47.5 12.43,47.87 v12.6,47.52 | 13.51,47.52 12.76,47.87 | 12.76,47.87 | v12.6,47.52 12.76,47.87 | 13.51,47.52 12.76,47.18 | v12.6,47.52 12.76,47.18 | 13.51,47.52 12.76,47.87 | v12.6,47.52 12.76,47.87 | 13.51,47.52 12.76,47.18 | v12.6,47.52 12.76,47.18
I2C1_SDA  (via drill 0.61)
  Top 0.254: U2.62 11.86,39.33 10.67,40.51 10.67,41.27 | 10.03,41.29 R11.1 10.04,41.27 10.67,41.27 | 10.67,41.27 10.67,42.93 7.87,45.72 7.87,47.24 9.04,48.41 10.41,48.41 | 10.41,48.41 v11.33,48.41 | 10.41,48.41 11.17,48.07 | 11.17,48.07 | v11.33,48.41 11.17,48.07 | 10.41,48.41 11.17,48.76 | v11.33,48.41 11.17,48.76 | 10.41,48.41 11.17,48.07 | v11.33,48.41 11.17,48.07 | 10.41,48.41 11.17,48.76 | v11.33,48.41 11.17,48.76
  Bottom 0.254: v11.33,48.41 11.32,48.41 | IC4.24 14.63,48.03 14.25,48.41 12.24,48.41 | IC5.16 10.43,47.51 10.68,47.77 | 10.68,47.77 | 10.68,47.77 v11.33,48.41 | v11.33,48.41 12.24,48.41 | 10.68,47.77 11.46,48.05 | v11.33,48.41 11.46,48.05 | 10.68,47.77 | 10.68,47.77 10.97,48.55 | v11.33,48.41 10.97,48.55 | 12.24,48.41 | 12.24,48.41 11.49,48.76 | v11.33,48.41 11.49,48.76 | 12.24,48.41 | 12.24,48.41 11.49,48.07 | v11.33,48.41 11.49,48.07 | 10.68,47.77 11.46,48.05 | 10.68,47.77 10.97,48.55 | 10.68,47.77 11.46,48.05 | v11.33,48.41 11.46,48.05 | 10.68,47.77 10.97,48.55 | v11.33,48.41 10.97,48.55 | 12.24,48.41 11.49,48.76 | 11.49,48.76 | v11.33,48.41 11.49,48.76 | 12.24,48.41 11.49,48.07 | v11.33,48.41 11.49,48.07 | 12.24,48.41 11.49,48.76 | v11.33,48.41 11.49,48.76 | 12.24,48.41 11.49,48.07 | v11.33,48.41 11.49,48.07
I2C2_SCL  (via drill 0.61)
  Top 0.254: U2.29 16.86,25.82 | 16.86,25.82 16.86,25.49 16.41,25.04 R15.2 | 16.86,25.82 16.16,25.36 R15.2 | 16.86,25.82 16.75,25 R15.2
  Bottom 0.254: 15.46,25.04 12.8,25.04 11.3,26.54 5.59,26.54 5.21,26.16 5.21,24.74 5.46,24.49 IC2.6 | 15.46,25.04 R15.2 | 15.46,25.04 16.21,24.7 | 16.21,24.7 | R15.2 16.21,24.7 | 15.46,25.04 16.21,25.39 | R15.2 16.21,25.39 | 15.46,25.04 16.21,24.7 | R15.2 16.21,24.7 | 15.46,25.04 16.21,25.39 | R15.2 16.21,25.39
  other vias: 16.37,25.04
I2C2_SDA  (via drill 0.61)
  Top 0.254: U2.30 17.36,23.96 17.04,23.64 | 17.04,23.64 16.41,23.01 R16.1 | 17.04,23.64 16.25,23.37 R16.1 | 17.04,23.64 16.72,22.87 R16.1
  Bottom 0.254: IC2.5 11.33,25.76 12.57,24.51 14.87,24.51 15.72,23.66 | 15.72,23.66 R16.1 | 15.72,23.66 | 15.72,23.66 16.01,22.88 | R16.1 16.01,22.88 | 15.72,23.66 | 15.72,23.66 16.5,23.37 | R16.1 16.5,23.37 | 15.72,23.66 16.01,22.88 | 15.72,23.66 16.5,23.37 | 15.72,23.66 16.01,22.88 | R16.1 16.01,22.88 | 15.72,23.66 16.5,23.37 | R16.1 16.5,23.37
  other vias: 16.37,23.01
N$2
  Bottom 0.254: U$12.B+ 6.47,14.58 R2.1
N$3
  Bottom 0.254: IC4.10 21.04,46.48 C26.1
N$4  (via drill 0.61)
  Top 0.254: U1.31 20.16,6.7 19.56,6.1 9.27,6.1 8.52,5.35 | v7.87,4.7 8.52,5.35 | 8.52,5.35 | 8.52,5.35 | 8.52,5.35 7.74,5.06 | v7.87,4.7 7.74,5.06 | 8.52,5.35 8.23,4.57 | v7.87,4.7 8.23,4.57 | 8.52,5.35 7.74,5.06 | 8.52,5.35 | 8.52,5.35 7.74,5.06 | v7.87,4.7 7.74,5.06 | 8.52,5.35 8.23,4.57 | v7.87,4.7 8.23,4.57
  Bottom 0.254: LD1.A 7.53,4.7 v7.87,4.7
N$5  (via drill 0.61)
  Top 0.254: v5.62,4.68 4.98,5.33 | 4.98,5.33 R9.1 | 4.98,5.33 | 4.98,5.33 5.27,4.55 | v5.62,4.68 5.27,4.55 | 4.98,5.33 | 4.98,5.33 5.76,5.04 | v5.62,4.68 5.76,5.04 | 4.98,5.33 5.27,4.55 | 4.98,5.33 5.76,5.04 | 4.98,5.33 5.27,4.55 | v5.62,4.68 5.27,4.55 | 4.98,5.33 5.76,5.04 | v5.62,4.68 5.76,5.04
  Bottom 0.254: LD1.C 6,4.68 v5.62,4.68
N$6
  Bottom 0.254: U$12.R+ 6.47,18.64 R6.1
N$7
  Bottom 0.254: U$12.G+ R3.1
N$8
  Bottom 0.254: IC4.20 13.59,45.98 C36.1
N$10
  Bottom 0.254: C27.1 8.28,40.79 8.93,41.44 IC5.8
N$11
  Top 0.254: LD2.C 5.74,35.88 R1.1
N$12
  Bottom 0.254: IC5.10 C28.+
N$13
  Bottom 0.254: IC5.12 8.31,45.34 7.67,45.97 4.83,45.97 3.56,44.7 3.56,41.75 C27.2
N$14
  Top 0.254: U2.5 3.08,34.26 Y2.2
  Bottom 0.254: C15.1 2.48,35.24 Y2.2
N$15
  Top 0.254: U2.6 3.15,33.76 2.29,32.89 Y2.1
  Bottom 0.254: C1.1 2.48,29.78 Y2.1
N$18
  Top 0.254: C18.1 17.86,25.39 U2.31
N$19  (via drill 0.61)
  Top 0.254: U2.47 21.69,35.76 | 21.69,35.76 22.21,35.76 C17.1 | 21.69,35.76 22.27,35.17 | C17.1 22.27,35.17 | 21.69,35.76 22.52,35.81 | C17.1 22.52,35.81 | 21.69,35.76 22.27,35.17 | C17.1 22.27,35.17 | 21.69,35.76 22.52,35.81 | C17.1 22.52,35.81
  other vias: 22.54,35.43
RGB_CH1  (via drill 0.61)
  Top 0.254: U2.14 9.73,29.76 10.03,29.46 10.03,28.57 9.53,28.07 8.38,28.07 3.3,22.99 3.3,16.27 2.48,15.46 | 2.48,15.46 | 2.48,15.46 U$12.B- | 2.48,15.46 | 2.48,15.46 1.71,15.17 | U$12.B- 1.71,15.17 | 2.48,15.46 2.2,14.68 | U$12.B- 2.2,14.68 | 2.48,15.46 1.71,15.17 | 2.48,15.46 | 2.48,15.46 1.71,15.17 | U$12.B- 1.71,15.17 | 2.48,15.46 2.2,14.68 | U$12.B- 2.2,14.68
  Bottom 0.254: U$12.B- 1.44,14.81 1.4,14.86 1.79,14.86 U$12.B-
  other vias: 1.84,14.81
RGB_CH2  (via drill 0.61)
  Top 0.254: U2.15 8.05,29.26 1.84,23.05 1.84,19.33 | U$12.R- 1.84,19.33 | 1.84,19.33 | 1.84,19.33 | 1.84,19.33 2.19,18.57 | 1.84,19.33 1.49,18.57 | 1.49,18.57 | U$12.R- 1.49,18.57 | 1.84,19.33 2.19,18.57 | U$12.R- 2.19,18.57 | 1.84,19.33 1.49,18.57 | U$12.R- 1.49,18.57 | 1.84,19.33 2.19,18.57 | U$12.R- 2.19,18.57
  Bottom 0.254: U$12.R- 1.27,18.41 U$12.R-
  other vias: 1.84,18.41
RGB_CH3  (via drill 0.61)
  Top 0.254: U2.16 8.31,28.76 2.79,23.24 2.79,17.57 2.48,17.26 | 2.48,17.26 | 2.48,17.26 U$12.G- | 2.48,17.26 | 2.48,17.26 1.71,16.97 | U$12.G- 1.71,16.97 | 2.48,17.26 2.2,16.48 | U$12.G- 2.2,16.48 | 2.48,17.26 1.71,16.97 | 2.48,17.26 | 2.48,17.26 1.71,16.97 | U$12.G- 1.71,16.97 | 2.48,17.26 2.2,16.48 | U$12.G- 2.2,16.48
  Bottom 0.254: U$12.G- 2.26,16.61 2.29,16.64 1.86,16.64 U$12.G-
  other vias: 1.84,16.61
SDIO_CLK  (via drill 0.61)
  Top 0.254: U2.53 16.36,37.37 16.76,36.96 18.41,36.96 20.32,38.86 23.24,38.86 25.65,36.45 25.65,30.89 | 25.65,30.89 v25.65,29.97 | 25.65,30.89 | 25.65,30.89 | 25.65,30.89 26,30.13 | 25.65,30.89 25.31,30.13 | 25.31,30.13 | v25.65,29.97 25.31,30.13 | 25.65,30.89 26,30.13 | v25.65,29.97 26,30.13 | 25.65,30.89 25.31,30.13 | v25.65,29.97 25.31,30.13 | 25.65,30.89 26,30.13 | v25.65,29.97 26,30.13
  Bottom 0.254: v25.65,29.97 25.58,29.9 24.74,29.9 | 24.74,29.9 SDCARD2.5 | 24.74,29.9 25.52,29.61 v25.65,29.97 | 24.74,29.9 25.47,30.3 v25.65,29.97
SDIO_CMD  (via drill 0.61)
  Top 0.254: U2.54 15.86,37.1 16.51,36.45 18.67,36.45 20.57,38.35 22.99,38.35 24.77,36.58 24.77,28.47 | v24.77,27.56 24.77,28.47 | 24.77,28.47 | 24.77,28.47 | 24.77,28.47 25.11,27.72 | 24.77,28.47 24.42,27.72 | 24.42,27.72 | v24.77,27.56 24.42,27.72 | 24.77,28.47 25.11,27.72 | v24.77,27.56 25.11,27.72 | 24.77,28.47 24.42,27.72 | v24.77,27.56 24.42,27.72 | 24.77,28.47 25.11,27.72 | v24.77,27.56 25.11,27.72
  Bottom 0.254: 23.94,27.71 23.93,27.7 | 23.93,27.96 23.93,27.94 | 23.93,27.94 23.93,27.7 | 23.79,27.69 SDCARD2.3 | SDCARD2.3 23.86,27.65 | 23.86,27.65 23.95,27.56 v24.77,27.56 | SDCARD2.3 23.86,27.7 | 23.86,27.7 23.93,27.7 | 23.93,27.94 24.48,27.31 v24.77,27.56 | 23.93,27.94 24.77,27.94 v24.77,27.56 | 23.86,27.65 24.57,27.23 | 23.86,27.65 24.64,27.92 | v24.77,27.56 24.64,27.92 | 23.86,27.65 24.57,27.23 | v24.77,27.56 24.57,27.23 | 23.86,27.65 24.64,27.92 | v24.77,27.56 24.64,27.92 | 23.86,27.7 24.55,27.24 v24.77,27.56 | 23.86,27.7 24.66,27.93 v24.77,27.56
SDIO_D0  (via drill 0.61)
  Top 0.254: U2.39 21.64,31.76 | 21.64,31.76 22.23,31.76 22.48,32.02 v22.48,32.13 | 21.64,31.76 22.47,31.75 v22.48,32.13 | 21.64,31.76 22.19,32.38 v22.48,32.13
  Bottom 0.254: SDCARD2.7 23.65,32.26 23.39,32.26 | 23.39,32.26 22.61,32.26 v22.48,32.13 | 23.39,32.26 22.59,32.5 v22.48,32.13 | 23.39,32.26 22.68,31.81 v22.48,32.13
SDIO_D1  (via drill 0.61)
  Top 0.254: U2.40 21.09,32.26 21.7,32.88 | 21.7,32.88 | 21.7,32.88 v22.35,33.53 | 21.7,32.88 22.48,33.17 | v22.35,33.53 22.48,33.17 | 21.7,32.88 | 21.7,32.88 22,33.66 | v22.35,33.53 22,33.66 | 21.7,32.88 22.48,33.17 | 21.7,32.88 22,33.66 | 21.7,32.88 22.48,33.17 | v22.35,33.53 22.48,33.17 | 21.7,32.88 22,33.66 | v22.35,33.53 22,33.66
  Bottom 0.254: v22.35,33.53 22.68,33.2 23.21,33.2 | 23.21,33.2 SDCARD2.8 | 23.21,33.2 22.62,33.8 v22.35,33.53 | 23.21,33.2 22.38,33.15 v22.35,33.53
SDIO_D2  (via drill 0.61)
  Top 0.254: U2.51 17.36,39.07 18.16,39.88 23.75,39.88 27.18,36.45 27.18,27.46 | 27.18,27.46 v27.18,26.54 | 27.18,27.46 | 27.18,27.46 | 27.18,27.46 27.52,26.7 | 27.18,27.46 26.83,26.7 | 26.83,26.7 | v27.18,26.54 26.83,26.7 | 27.18,27.46 27.52,26.7 | v27.18,26.54 27.52,26.7 | 27.18,27.46 26.83,26.7 | v27.18,26.54 26.83,26.7 | 27.18,27.46 27.52,26.7 | v27.18,26.54 27.52,26.7
  Bottom 0.254: SDCARD2.1 23.83,25.53 26.16,25.53 26.53,25.9 | 26.53,25.9 | 26.53,25.9 v27.18,26.54 | 26.53,25.9 27.31,26.19 | v27.18,26.54 27.31,26.19 | 26.53,25.9 | 26.53,25.9 26.82,26.68 | v27.18,26.54 26.82,26.68 | 26.53,25.9 27.31,26.19 | 26.53,25.9 26.82,26.68 | 26.53,25.9 27.31,26.19 | v27.18,26.54 27.31,26.19 | 26.53,25.9 26.82,26.68 | v27.18,26.54 26.82,26.68
SDIO_D3  (via drill 0.61)
  Top 0.254: U2.52 16.86,39.33 17.91,40.39 24,40.39 28.19,36.2 28.19,26.16 27.82,25.79 | v27.18,25.15 27.82,25.79 | 27.82,25.79 | 27.82,25.79 | 27.82,25.79 27.05,25.5 | v27.18,25.15 27.05,25.5 | 27.82,25.79 27.54,25.01 | v27.18,25.15 27.54,25.01 | 27.82,25.79 27.05,25.5 | 27.82,25.79 | 27.82,25.79 27.05,25.5 | v27.18,25.15 27.05,25.5 | 27.82,25.79 27.54,25.01 | v27.18,25.15 27.54,25.01
  Bottom 0.254: SDCARD2.2 22.92,26.6 22.61,26.29 22.61,24.89 22.99,24.51 26.52,24.51 | 26.52,24.51 26.54,24.51 v27.18,25.15 | 26.52,24.51 27.3,24.79 v27.18,25.15 | 26.52,24.51 26.82,25.29 v27.18,25.15
SDIO_DETECT  (via drill 0.61)
  Top 0.254: U2.36 16.92,30.26 | 16.92,30.26 16.04,30.26 v16,30.23 | 16.92,30.26 16.15,30.58 v16,30.23 | 16.92,30.26 16.17,29.89 v16,30.23
  Bottom 0.254: 13.46,26.74 SDCARD2.CD2 16,29.19 16,29.31 | v16,30.23 16,29.31 | 16,29.31 16.35,30.07 | v16,30.23 16.35,30.07 | 16,29.31 15.66,30.07 | v16,30.23 15.66,30.07 | 16,29.31 16.35,30.07 | 16.35,30.07 | v16,30.23 16.35,30.07 | 16,29.31 15.66,30.07 | v16,30.23 15.66,30.07 | 16,29.31 16.35,30.07 | v16,30.23 16.35,30.07 | 16,29.31 15.66,30.07 | v16,30.23 15.66,30.07
SW-!RESET  (via drill 0.61)
  Top 0.254: U2.7 4.69,33.26 4.06,32.64 4.06,30.1 | C13.1 5.27,30.1 4.06,30.1 | 4.06,30.1 4.06,26.04 0.89,22.86 0.89,6.73 2.29,5.33 3.3,5.33 4.93,3.71 JP4.5 12.7,0.76 22.35,0.76 26.67,5.08 26.67,23.24 28.7,25.27 28.7,39.94 | 28.7,40.39 v28.32,40.77 | 28.7,40.39 28.7,40.77 v28.32,40.77 | 28.7,39.94 28.7,40.39 | 28.7,39.94 28.07,40.48 v28.32,40.77
  Bottom 0.254: S1.P$2 v28.32,40.77
SW_CLK
  Top 0.254: JP4.4 14.73,1.27 22.1,1.27 26.16,5.33 26.16,27.69 26.54,28.07 26.54,36.32 23.5,39.37 18.61,39.37 18.36,39.12 U2.49
SW_DIO
  Top 0.254: U2.46 21.25,35.26 22.1,34.42 23.11,34.42 23.62,33.91 23.62,26.8 25.65,24.77 25.65,5.59 21.84,1.78 19.3,1.78 JP4.2

### Text on the board
Bottom: SENSE
tNames: SENSE V3 | vnd241092@gmail.com
bNames: Y | X